# Altium project Full_PCB.PrjPcb
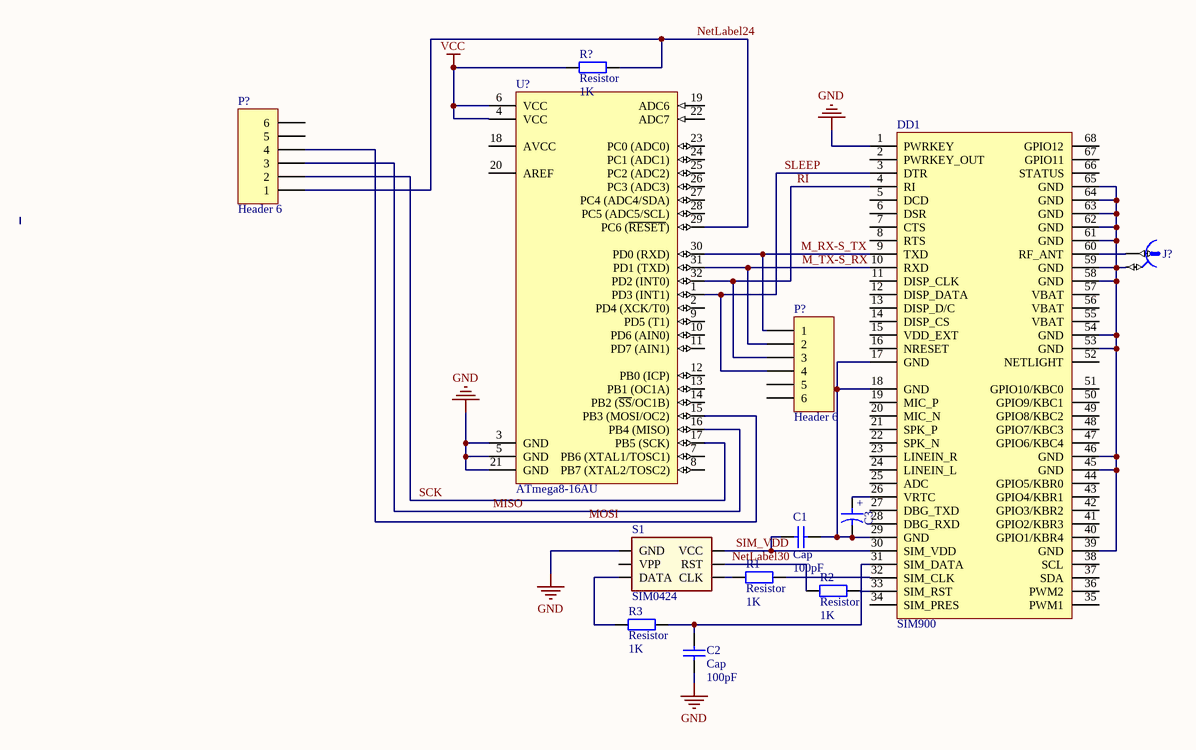
[diagram p0: Sheet1.SchDoc]
1 sheet, 13 parts. Net scope: global (net labels, ports and power ports of the same name join across sheets).
Board file: PCB1.PcbDoc

## Sheet Sheet1.SchDoc
size A4

### Parts
(Parts that share a designator on the sheet are numbered #1, #2 ... from top to bottom, then left to right.)
C1  Cap  value 100pF  [CAPC(0805)2012X07N]
C2  Cap  value 100pF  [CAPC(0805)2012X07N]
C3  10uF  [CAPMP7343X310N]  (value not drawn)
DD1  SIM900  [SIM900]
J?  U.FL  [HIROSE_U.FL-R-SMT-1(10)]  (value not drawn)
P?#1  Header 6  [HDR1X6]
P?#2  Header 6  [HDR1X6]
R1  Resistor  value 1K  [RESC(0805)2112X05N]
R2  Resistor  value 1K  [RESC(0805)2112X05N]
R3  Resistor  value 1K  [RESC(0805)2112X05N]
R?  Resistor  value 1K  [RESC(0805)2112X05N_wave]
S1  SIM0424  [SIM0424]
U?  ATmega8-16AU  [32A_N]

### Nets
GND: C2.1 DD1.1(PWRKEY) S1.4(GND) U?.3(GND) U?.5(GND) U?.21(GND)
VCC: R?.1 U?.4(VCC) U?.6(VCC)
M_RX-S_TX: DD1.9(TXD) P?#2.1 U?.30(PD0_(RXD))
M_TX-S_RX: DD1.10(RXD) P?#2.2 U?.31(PD1_(TXD))
MISO: P?#1.3 U?.16(PB4_(MISO))
MOSI: P?#1.4 U?.15(PB3_(MOSI/OC2))
NetLabel24: P?#1.1 R?.2 U?.29(PC6_(~{RESET}))
NetLabel30: R2.1 S1.2(RST)
RI: DD1.4(RI) P?#2.3 U?.32(PD2_(INT0))
SCK: P?#1.2 U?.17(PB5_(SCK))
SIM_VDD: C1.1 DD1.30(SIM_VDD) S1.1(VCC)
SLEEP: DD1.3(DTR) P?#2.4 U?.1(PD3_(INT1))
NetC1_2: C1.2 C3.2 DD1.17(GND) DD1.18(GND) DD1.29(GND)
NetC2_2: C2.2 DD1.31(SIM_DATA) R3.2
NetC3_1: C3.1 DD1.26(VRTC)
NetDD1_32: DD1.32(SIM_CLK) R1.2
NetDD1_33: DD1.33(SIM_RST) R2.2
NetDD1_39: DD1.39(GND) DD1.45(GND) DD1.46(GND) DD1.53(GND) DD1.54(GND) DD1.58(GND) DD1.59(GND) DD1.61(GND) DD1.62(GND) DD1.63(GND) DD1.64(GND) DD1.65(GND) J?.2
NetDD1_60: DD1.60(RF_ANT) J?.1
NetR1_1: R1.1 S1.3(CLK)
NetR3_1: R3.1 S1.6(DATA)

Not connected (* = marked no-connect by the designer): DD1 2(PWRKEY_OUT) 5(DCD) 6(DSR) 7(CTS) 8(RTS) 11(DISP_CLK) 12(DISP_DATA) 13(DISP_D/C) 14(DISP_CS) 15(VDD_EXT) 16(NRESET) 19(MIC_P) 20(MIC_N) 21(SPK_P) 22(SPK_N) 23(LINEIN_R) 24(LINEIN_L) 25(ADC) 27(DBG_TXD) 28(DBG_RXD) 34(SIM_PRES) 35(PWM1) 36(PWM2) 37(SDA) 38(SCL) 40(GPIO1/KBR4) 41(GPIO2/KBR3) 42(GPIO3/KBR2) 43(GPIO4/KBR1) 44(GPIO5/KBR0) 47(GPIO6/KBC4) 48(GPIO7/KBC3) 49(GPIO8/KBC2) 50(GPIO9/KBC1) 51(GPIO10/KBC0) 52(NETLIGHT) 55(VBAT) 56(VBAT) 57(VBAT) 66(STATUS) 67(GPIO11) 68(GPIO12); P?#1 5 6; P?#2 5 6; S1 5(VPP); U? 2(PD4_(XCK/T0)) 7(PB6_(XTAL1/TOSC1)) 8(PB7_(XTAL2/TOSC2)) 9(PD5_(T1)) 10(PD6_(AIN0)) 11(PD7_(AIN1)) 12(PB0_(ICP)) 13(PB1_(OC1A)) 14(PB2_(~{SS}/OC1B)) 18(AVCC) 19(ADC6) 20(AREF) 22(ADC7) 23(PC0_(ADC0)) 24(PC1_(ADC1)) 25(PC2_(ADC2)) 26(PC3_(ADC3)) 27(PC4_(ADC4/SDA)) 28(PC5_(ADC5/SCL))

### Notes on the sheet
- (in symbol CTE7343-31_10UF_25V_10%) +

### Library data of the parts
C1 C2 = Cap: Capacitor
C3 = CTE7343-31_10UF_25V_10%: Polarised capacitor; Part Description: Solid Tantalum Chip Capacitor; Manufacturer: GENERIC; Manufacturer1 Part Number: TAJD106K025R; Voltage: 25V; Tolerance: ±10%; Table: Capacitors SMD; Part Number: CTE7343-31_10UF_25V_10%; Component Kind: Standard; Component Type: Standard; Pin Count: 2; Value: 10uF; Status: Preferred; Manufacturer Part Number: CTE7343-31_10UF_25V_10%; Case: D; Mounted: Yes; Socket: No; SMD: Yes; Manufacturer1 Example: AVX; Manufacturer1 ComponentHeight: 3.1mm; HelpURL: \\cern.ch\dfs\Applications\Altium\Datasheets\CTE_AVX_TAJ.pdf; Author: CERN DEM JMW; CreateDate: 17.10.2008; LatestRevisionDate: 17.10.2008
DD1 = SIM900: GSM/GPRS module SIM900; Autor: Yanichar http://zeroelectronics.ru/autor; Order: SIM900; Value: SIM900
J? = HIROSE_U.FL-R-SMT-1(10): Part Description: Up to 6GHz Ultra Small Surface Mount Male Coaxial Connectors U.FL Series; Manufacturer: HIROSE (HRS); Table: Miscellaneous; Part Number: HIROSE_U.FL-R-SMT-1(10); Component Kind: Standard; Component Type: Standard; Pin Count: 2; Family: U.FL; Mounted: Yes; Socket: No; SMD: Yes; Status: None; Manufacturer Part Number: U.FL-R-SMT-1(10); ComponentHeight: 1.25mm; HelpURL: \\cern.ch\dfs\Applications\Altium\Datasheets\HIROSE_U.FL-R-SMT-1(10).pdf; Author: CERN DEM JLC; CreateDate: 24.03.2010; LatestRevisionDate: 24.03.2010
P?#1 P?#2 = Header 6: Header, 6-Pin; LatestRevisionDate: 17-Jul-2002; LatestRevisionNote: Re-released for DXP Platform.; Publisher: Altium Limited
S1 = SIM0424: Sim Socket SIM0424; DataSheet: http://www.farnell.com/datasheets/1796466.pdf
U? = ATmega8-16AU: 8-bit AVR Microcontroller, 4.5-5.5V, 16MHz, 8KB Flash, 512 Bytes EEPROM, 1KB SRAM, 32-pin TQFP, Industrial Grade (-40°C to 85°C); DatasheetVersion: revZ, Feb-2011; PackageVersion: revC, Oct-2010; PackageReference: 32A; PackageDescription: 32-Lead, 7x7x1.0 mm Body, 0.8mm Lead Pitch, Thin Profile Plastic Quad Flat Package (TQFP); Code_JEDEC: MS-026-ABA; ComponentLink1Description: Manufacturer URL; ComponentLink1URL: http://www.atmel.com/; ComponentLink2Description: ATmega8(L); ComponentLink2URL: http://www.atmel.com/dyn/resources/prod_documents/doc2486.pdf; ComponentLink3Description: ATmega8(L) Summary; ComponentLink3URL: http://www.atmel.com/dyn/resources/prod_documents/2486S.pdf